# EAGLE design trans48 (EAGLE 6.3)
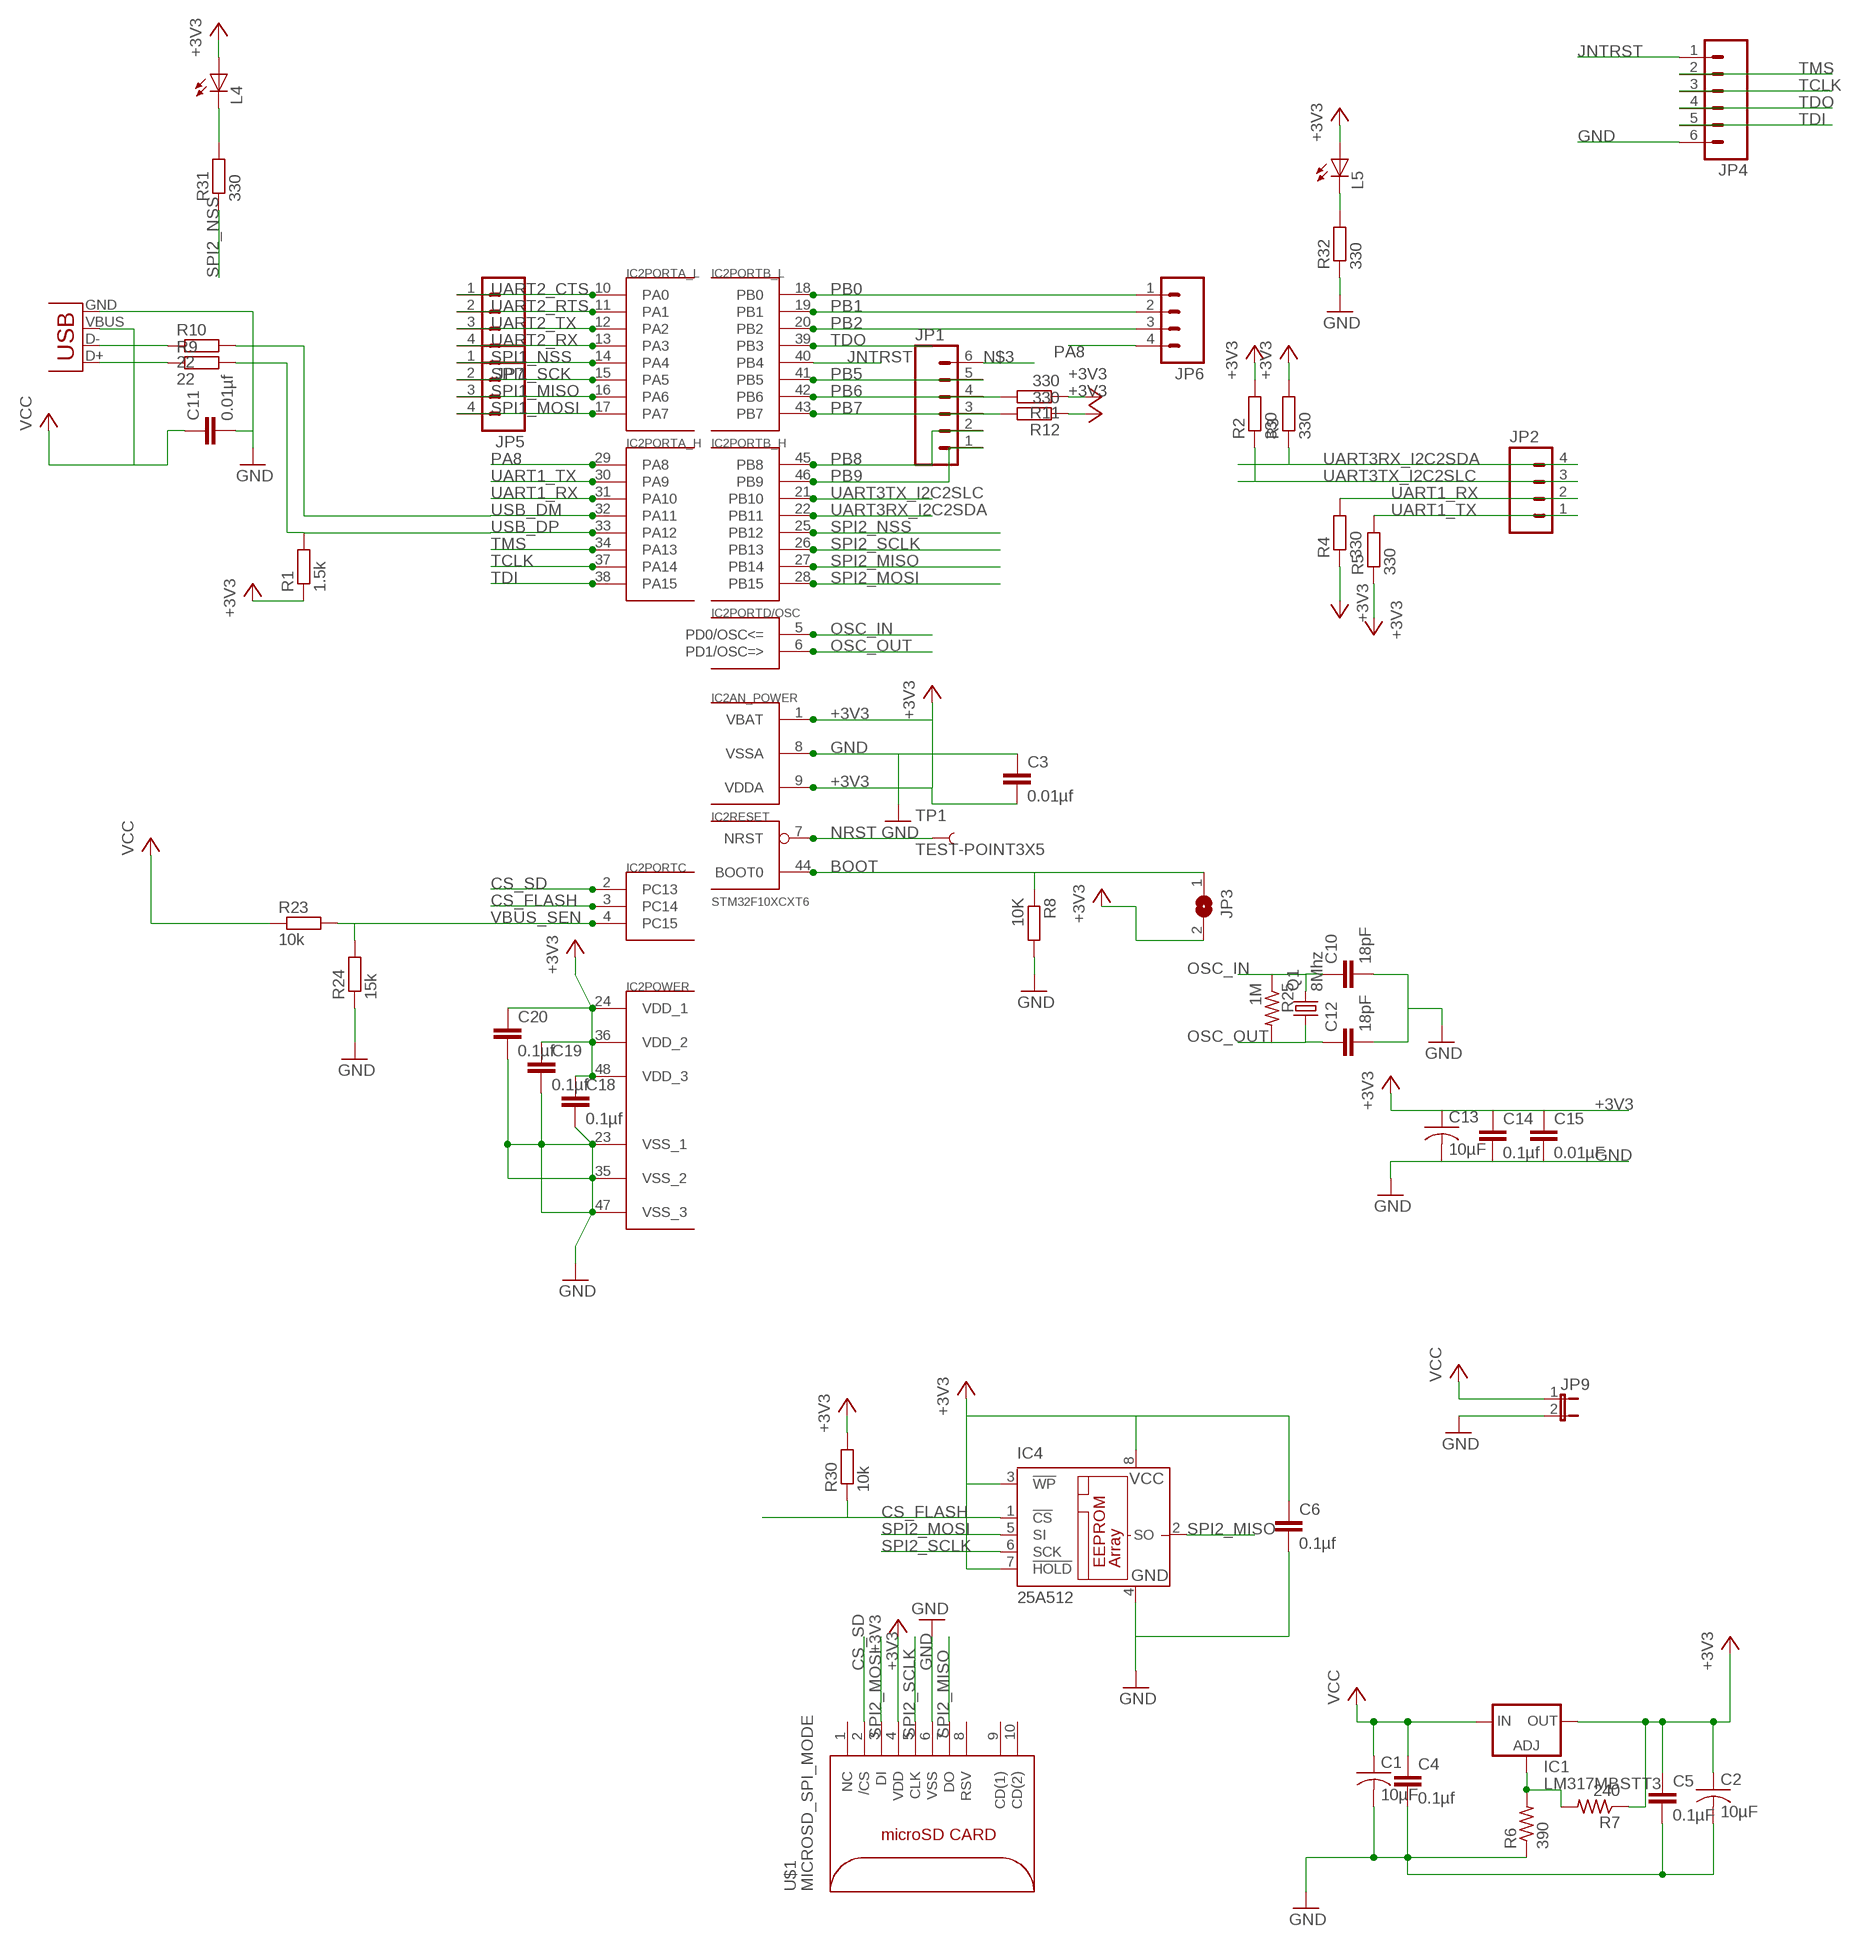
[diagram p0: schematic, sheet 1]

## Parts
C1  10µF  C-USC1206  [C1206]
C2  10µF  C-USC1206  [C1206]
C3  0.01µf  C-EUC0402  [C0402]
C4  0.1µf  C-EUC0402  [C0402]
C5  0.1µF  C-EUC0402  [C0402]
C6  0.1µf  C-EUC0402  [C0402]
C10  18pF  C-EUC0603  [C0603]
C11  0.01µf  C-EUC0402  [C0402]
C12  18pF  C-EUC0603  [C0603]
C13  10µF  C-USC1206  [C1206]
C14  0.1µf  C-EUC0603  [C0603]
C15  0.01µF  C-EUC0603  [C0603]
C18  0.1µf  C-EUC0402  [C0402]
C19  0.1µf  C-EUC0402  [C0402]
C20  0.1µf  C-EUC0402  [C0402]
IC1  LM317MBSTT3  [SOT223]
IC2  STM32F10XCXT6  [TQFP48]
IC4  25A512  25AA080SN  [SO-08]
JP1  M06EM406  [EM406]
JP2  M04SMD2  [1X04-1MM-RA]
JP3  SJ  [SJ]
JP4  M06EM406  [EM406]
JP5  M04SMD2  [1X04-1MM-RA]
JP6  M04SMD2  [1X04-1MM-RA]
JP7  M04SMD2  [1X04-1MM-RA]
JP9  JUMPER-2SMD-NO-NS  [SJ_2S-NO-NS]
L4  LEDSML0603  [SML0603]
L5  LEDSML0603  [SML0603]
Q1  8Mhz  CRYSTALSM49  [SM49]
R1  1.5k  R-EU_R0402  [R0402]
R2  330  R-EU_R0402  [R0402]
R3  330  R-EU_R0402  [R0402]
R4  330  R-EU_R0402  [R0402]
R5  330  R-EU_R0402  [R0402]
R6  390  R-US_R0603  [R0603]
R7  240  R-US_R0603  [R0603]
R8  10K  R-EU_R0402  [R0402]
R9  22  R-EU_R0402  [R0402]
R10  22  R-EU_R0402  [R0402]
R11  330  R-EU_R0402  [R0402]
R12  330  R-EU_R0402  [R0402]
R23  10k  R-EU_R0402  [R0402]
R24  15k  R-EU_R0402  [R0402]
R25  1M  R-US_R0603  [R0603]
R30  10k  R-EU_R0402  [R0402]
R31  330  R-EU_R0402  [R0402]
R32  330  R-EU_R0402  [R0402]
TP1  TEST-POINT3X5  [PAD.03X.05]
U$1  MICROSD_SPI_MODE  [MICRO_SD_CONNECTOR]
X1  USB-MICROB  [USB-MICROB]

## Nets
+3V3: C2.1 C3.2 C5.1 C6.1 C13.1 C14.1 C15.1 C18.1 C19.1 C20.1 IC1.4(OUT) IC2.1(AN_POWER:VBAT) IC2.9(AN_POWER:VDDA) IC2.24(POWER:VDD_1) IC2.36(POWER:VDD_2) IC2.48(POWER:VDD_3) IC4.3(!WP) IC4.7(!HOLD) IC4.8(VCC) JP3.2 L4.A L5.A R1.1 R2.2 R3.2 R4.1 R5.1 R7.1 R11.1 R12.1 R30.2 U$1.4(VDD)
BOOT: IC2.44(RESET:BOOT0) JP3.1 R8.1
CS_FLASH: IC2.3(PORTC:PC14) IC4.1(!CS) R30.1
CS_SD: IC2.2(PORTC:PC13) U$1.2(/CS)
GND: C1.2 C2.2 C3.1 C4.2 C5.2 C6.2 C10.2 C11.2 C12.2 C13.2 C14.2 C15.2 C18.2 C19.2 C20.2 IC2.8(AN_POWER:VSSA) IC2.23(POWER:VSS_1) IC2.35(POWER:VSS_2) IC2.47(POWER:VSS_3) IC4.4(GND) JP4.6 JP9.2 R6.1 R8.2 R24.1 R32.1 U$1.6(VSS) X1.GND
JNTRST: IC2.40(PORTB_L:PB4) JP4.1
N$1: R10.1 X1.D-
N$2: R9.1 X1.D+
N$3: JP1.6
N$14: L4.C R31.2
N$15: L5.C R32.2
N$34: IC1.1(ADJ) R6.2 R7.2
NRST: IC2.7(RESET:NRST) TP1.P$1
OSC_IN: C10.1 IC2.5(PORTD/OSC:PD0/OSC<=) Q1.2 R25.1
OSC_OUT: C12.1 IC2.6(PORTD/OSC:PD1/OSC=>) Q1.1 R25.2
PA8: IC2.29(PORTA_H:PA8) JP6.4
PB0: IC2.18(PORTB_L:PB0) JP6.1
PB1: IC2.19(PORTB_L:PB1) JP6.2
PB2: IC2.20(PORTB_L:PB2) JP6.3
PB5: IC2.41(PORTB_L:PB5) JP1.5
PB6: IC2.42(PORTB_L:PB6) JP1.4 R11.2
PB7: IC2.43(PORTB_L:PB7) JP1.3 R12.2
PB8: IC2.45(PORTB_H:PB8) JP1.2
PB9: IC2.46(PORTB_H:PB9) JP1.1
SPI1_MISO: IC2.16(PORTA_L:PA6) JP5.3
SPI1_MOSI: IC2.17(PORTA_L:PA7) JP5.4
SPI1_NSS: IC2.14(PORTA_L:PA4) JP5.1
SPI1_SCK: IC2.15(PORTA_L:PA5) JP5.2
SPI2_MISO: IC2.27(PORTB_H:PB14) IC4.2(SO) U$1.7(DO)
SPI2_MOSI: IC2.28(PORTB_H:PB15) IC4.5(SI) U$1.3(DI)
SPI2_NSS: IC2.25(PORTB_H:PB12) R31.1
SPI2_SCLK: IC2.26(PORTB_H:PB13) IC4.6(SCK) U$1.5(CLK)
TCLK: IC2.37(PORTA_H:PA14) JP4.3
TDI: IC2.38(PORTA_H:PA15) JP4.5
TDO: IC2.39(PORTB_L:PB3) JP4.4
TMS: IC2.34(PORTA_H:PA13) JP4.2
UART1_RX: IC2.31(PORTA_H:PA10) JP2.2 R4.2
UART1_TX: IC2.30(PORTA_H:PA9) JP2.1 R5.2
UART2_CTS: IC2.10(PORTA_L:PA0) JP7.1
UART2_RTS: IC2.11(PORTA_L:PA1) JP7.2
UART2_RX: IC2.13(PORTA_L:PA3) JP7.4
UART2_TX: IC2.12(PORTA_L:PA2) JP7.3
UART3RX_I2C2SDA: IC2.22(PORTB_H:PB11) JP2.4 R3.1
UART3TX_I2C2SLC: IC2.21(PORTB_H:PB10) JP2.3 R2.1
USB_DM: IC2.32(PORTA_H:PA11) R10.2
USB_DP: IC2.33(PORTA_H:PA12) R1.2 R9.2
VBUS_SEN: IC2.4(PORTC:PC15) R23.2 R24.2
VCC: C1.1 C4.1 C11.1 IC1.3(IN) JP9.1 R23.1 X1.VBUS
Unconnected: U$1.1(NC) U$1.8(RSV) U$1.9(CD(1)) U$1.10(CD(2))

## Library data of the parts
C1 C2 C13 = rcl:C-US: CAPACITOR, American symbol
C3-C6 C10-C12 C14 C15 C18-C20 = rcl:C-EU: CAPACITOR, European symbol
IC1 = v-reg:LM317?*: 500 mA Adjustable Output Positive Voltage Regulator Source: http://www.onsemi.co.jp .. LM317M-D.PDF
IC2 = stm32:STM32F10XCXT6: ST STM32F101/103 48pin LQFP
IC4 = microchip:25*: Serial EEPROM 4K/ 8K , SPI bus
JP1 JP4 = SparkFun:M06: Header 6 Standard 6-pin 0.1" header. Use with straight break away headers (SKU : PRT-00116), right angle break away headers (PRT-00553), swiss pins (PRT-00743), machine pins (PRT-00117), and female headers (PRT-00115). Molex polarized connector foot print use with SKU : PRT-08094 with associated crimp pins and housings. NOTES ON THE VARIANTS LOCK and LOCK_LONGPADS... This footprint was designed to help hold the alignment of a through-hole component (i.e. 6-pin header) while soldering it into place. You may notice that each hole has been shifted either up or down by 0.005 of an inch from it's more standard position (which is a perfectly straight line). This slight alteration caused the pins (the squares in the middle) to touch the edges of the holes. Because they are alternating, it causes a "brace" to hold the component in place. 0.005 has proven to be the perfect amount of "off-center" position when using our standard breakaway headers. Although looks a little odd when you look at the bare footprint, once you have a header in there, the alteration is very hard to notice. Also, if you push a header all the way into place, it is covered up entirely on the bottom side. This idea of altering the position of holes to aid alignment will be further integrated into the Sparkfun Library for other footprints. It can help hold any component with 3 or more connection pins.
JP2 JP5-JP7 = SparkFun:M04: Header 4 Standard 4-pin 0.1" header. Use with straight break away headers (SKU : PRT-00116), right angle break away headers (PRT-00553), swiss pins (PRT-00743), machine pins (PRT-00117), and female headers (PRT-00115). Molex polarized connector foot print use with SKU : PRT-08231 with associated crimp pins and housings. 1MM SMD Version SKU: PRT-10208
JP3 = jumper:SJ: SMD solder JUMPER
JP9 = SparkFun:JUMPER-2: Jumper Basic 0.1" spaced jumper. Use with breakaway headers.
L4 L5 = led:LED: LED OSRAM: - CHIPLED LG R971, LG N971, LY N971, LG Q971, LY Q971, LO R971, LY R971 LH N974, LH R974 LS Q976, LO Q976, LY Q976 LO Q996 - Hyper CHIPLED LW Q18S LB Q993, LB Q99A, LB R99A - SideLED LS A670, LO A670, LY A670, LG A670, LP A670 LB A673, LV A673, LT A673, LW A673 LH A674 LY A675 LS A676, LA A676, LO A676, LY A676, LW A676 LS A679, LY A679, LG A679 - Hyper Micro SIDELED® LS Y876, LA Y876, LO Y876, LY Y876 LT Y87S - SmartLED LW L88C, LW L88S LB L89C, LB L89S, LG L890 LS L89K, LO L89K, LY L89K LS L896, LA L896, LO L896, LY L896 - TOPLED LS T670, LO T670, LY T670, LG T670, LP T670 LSG T670, LSP T670, LSY T670, LOP T670, LYG T670 LG T671, LOG T671, LSG T671 LB T673, LV T673, LT T673, LW T673 LH T674 LS T676, LA T676, LO T676, LY T676, LB T676, LH T676, LSB T676, LW T676 LB T67C, LV T67C, LT T67C, LS T67K, LO T67K, LY T67K, LW E67C LS E67B, LA E67B, LO E67B, LY E67B, LB E67C, LV E67C, LT E67C LW T67C LS T679, LY T679, LG T679 LS T770, LO T770, LY T770, LG T770, LP T770 LB T773, LV T773, LT T773, LW T773 LH T774 LS E675, LA E675, LY E675, LS T675 LS T776, LA T776, LO T776, LY T776, LB T776 LHGB T686 LT T68C, LB T68C - Hyper Mini TOPLED® LB M676 - Mini TOPLED Santana® LG M470 LS M47K, LO M47K, LY M47K Source: http://www.osram.convergy.de LUXEON: - LUMILED® LXK2-PW12-R00, LXK2-PW12-S00, LXK2-PW14-U00, LXK2-PW14-V00 LXK2-PM12-R00, LXK2-PM12-S00, LXK2-PM14-U00 LXK2-PE12-Q00, LXK2-PE12-R00, LXK2-PE12-S00, LXK2-PE14-T00, LXK2-PE14-U00 LXK2-PB12-K00, LXK2-PB12-L00, LXK2-PB12-M00, LXK2-PB14-N00, LXK2-PB14-P00, LXK2-PB14-Q00 LXK2-PR12-L00, LXK2-PR12-M00, LXK2-PR14-Q00, LXK2-PR14-R00 LXK2-PD12-Q00, LXK2-PD12-R00, LXK2-PD12-S00 LXK2-PH12-R00, LXK2-PH12-S00 LXK2-PL12-P00, LXK2-PL12-Q00, LXK2-PL12-R00 Source: www.luxeon.com KINGBRIGHT: KA-3528ASYC Source: www.kingbright.com
Q1 = crystal:CRYSTAL: CRYSTAL
R1-R5 R8-R12 R23 R24 R30-R32 = rcl:R-EU_: RESISTOR, European symbol
R6 R7 R25 = resistor:R-US_: RESISTOR, American symbol
TP1 = SparkFun:TEST-POINT
U$1 = con-molex-microsd:MICROSD_SPI_MODE: MOLEX - 49225-0821 - CONNECTEUR MICRO SD PUSH/PUSH REV Fabricant: MOLEX Code commande Farnell: 1366700 <http://fr.farnell.com/molex/49225-0821/connecteur-micro-sd-push-push-rev/dp/1366700?Ntt=1366700> Référence fabricant: 49225-0821
X1 = SparkFun:USB: USB Connectors USB-B-PTH is fully proven SKU : PRT-00139 USB-miniB is fully proven SKU : PRT-00587 USB-A-PCB is untested. USB-A-H is throughly reviewed, but untested. Spark Fun Electronics SKU : PRT-00437 USB-B-SMT is throughly reviewed, but untested. Needs silkscreen touching up. USB-A-S has not been used/tested USB-MB-H has not been used/tested

## Board
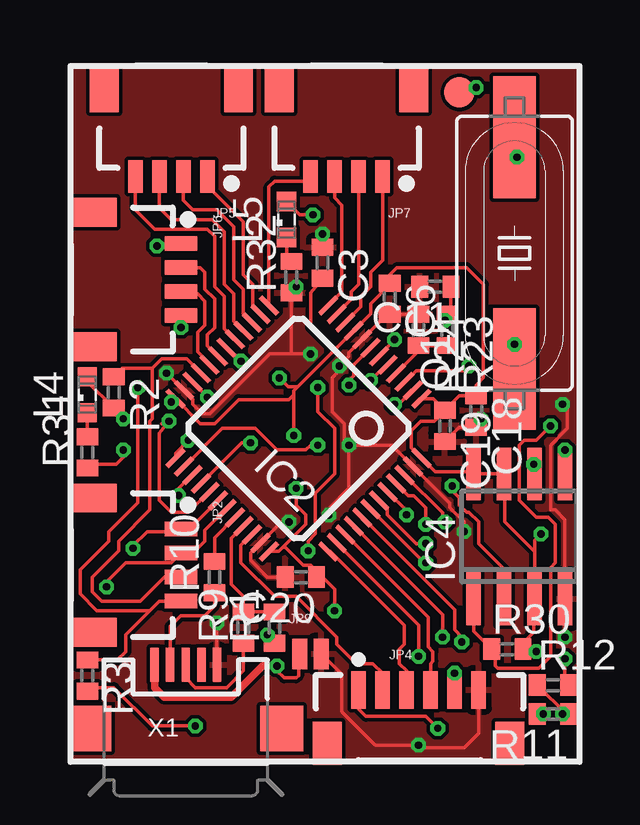
[diagram p1: board, top side]
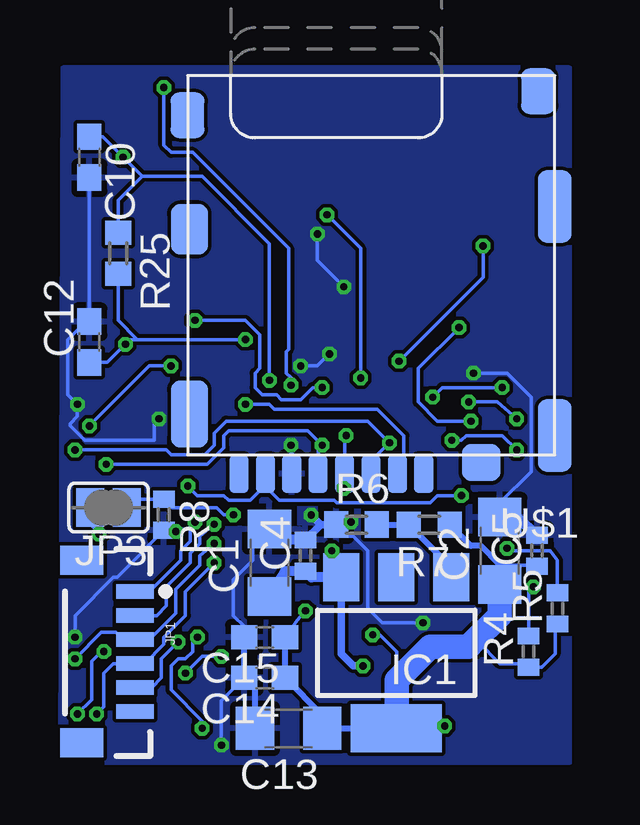
[diagram p2: board, bottom side, seen from below]

No outline drawn. Coordinates in mm, seen from the top.
Copper layers (1*16): Top 0.035mm / dielectric 1.5mm / Bottom 0.035mm
Design rules "Fusion_eagle_rule_v1.1": minimum track width 6mil, minimum drill 12mil, track to track 6mil, track to pad 6mil, pad to pad 6mil, via to via 6mil, smd to smd 0mil, copper to edge 10mil, drill to drill 10mil, minimum pad ring 10mil, minimum via ring 6mil, stop-mask expansion 2mil, vias tented up to drill 100mil, thermal gap 10mil

### Footprints (pad centres in the part's own frame; a part is rotated, then mirrored left to right if it is on the bottom)
C1206 = smd 1.6 x 1.8: 1 -1.4,0; 2 1.4,0
C0402 = smd 0.7 x 0.9: 1 -0.65,0; 2 0.65,0
C0603 = smd 1.1 x 1: 1 -0.85,0; 2 0.85,0
SOT223 = smd 1.5 x 2: 1 -2.3,-3.15; 2 0,-3.15; 3 2.3,-3.15 | smd 3.8 x 2: 4 0,3.15
TQFP48 = smd 0.2 x 1: 1 -2.75,-4.5; 2 -2.25,-4.5; 3 -1.75,-4.5; 4 -1.25,-4.5; 5 -0.75,-4.5; 6 -0.25,-4.5; 7 0.25,-4.5; 8 0.75,-4.5; 9 1.25,-4.5; 10 1.75,-4.5; 11 2.25,-4.5; 12 2.75,-4.5; 25 2.75,4.5; 26 2.25,4.5; 27 1.75,4.5; 28 1.25,4.5; 29 0.75,4.5; 30 0.25,4.5; 31 -0.25,4.5; 32 -0.75,4.5; 33 -1.25,4.5; 34 -1.75,4.5; 35 -2.25,4.5; 36 -2.75,4.5 | smd 1 x 0.2: 13 4.5,-2.75; 14 4.5,-2.25; 15 4.5,-1.75; 16 4.5,-1.25; 17 4.5,-0.75; 18 4.5,-0.25; 19 4.5,0.25; 20 4.5,0.75; 21 4.5,1.25; 22 4.5,1.75; 23 4.5,2.25; 24 4.5,2.75; 37 -4.5,2.75; 38 -4.5,2.25; 39 -4.5,1.75; 40 -4.5,1.25; 41 -4.5,0.75; 42 -4.5,0.25; 43 -4.5,-0.25; 44 -4.5,-0.75; 45 -4.5,-1.25; 46 -4.5,-1.75; 47 -4.5,-2.25; 48 -4.5,-2.75
SO-08 = smd 0.6 x 2.2: 1 -1.905,-2.6; 2 -0.635,-2.6; 3 0.635,-2.6; 4 1.905,-2.6; 5 1.905,2.6; 6 0.635,2.6; 7 -0.635,2.6; 8 -1.905,2.6
EM406 = smd 0.6 x 1.55: 1 0,0; 2 1,0; 3 2,0; 4 3,0; 5 4,0; 6 5,0 | smd 1.2 x 1.8: P$1 -1.3,-2.225; P$2 6.3,-2.225
1X04-1MM-RA = smd 0.6 x 1.35: 1 -1.5,0; 2 -0.5,0; 3 0.5,0; 4 1.5,0 | smd 1.2 x 2: NC1 2.8,-3.675; NC2 -2.8,-3.675
SJ = smd 1.168 x 1.6: 1 -0.762,0; 2 0.762,0
SJ_2S-NO-NS = smd 0.635 x 1.27: 1 -0.45,0; 2 0.45,0
SML0603 = smd 0.8 x 0.8: A 0.75,0; C -0.75,0
SM49 = smd 5.08 x 1.778: 1 -4.826,0; 2 4.826,0
R0402 = smd 0.7 x 0.9: 1 -0.65,0; 2 0.65,0
R0603 = smd 1 x 1.1: 1 -0.85,0; 2 0.85,0
PAD.03X.05 = smd 1.27 x 1.27: P$1 0,0
MICRO_SD_CONNECTOR = smd 0.8 x 1.6: 1 -2.03,8.2; 2 -0.93,8.2; 3 0.17,8.2; 4 1.27,8.2; 5 2.37,8.2; 6 3.47,8.2; 7 4.57,8.2; 8 5.67,8.2 | smd 1.55 x 2.8: 9 7.735,5.7 | smd 1.55 x 2.1: 10 7.735,-2 | smd 1.4 x 1.9: 11 7.81,-6.75; 12 -6.79,-7.75 | smd 1.4 x 3: 13 -7.49,-2.95; 14 -7.49,6.6 | smd 1.6 x 1.55: 15 -4.43,7.725
USB-MICROB = smd 0.35 x 1.4: D+ 0,2.65; D- -0.65,2.65; GND 1.3,2.65; ID 0.65,2.65; VBUS -1.3,2.65 | smd 1.8 x 1.9: MT1 -4,0; MT2 4,0

### Placement (x,y rotation side)
C1  12.5,8.3 90 bottom
C2  2.9,8.8 90 bottom
C3  10.5,20.8 270 top
C4  11,8.6 90 bottom
C5  1.35,8.8 90 bottom
C6  13.3,19.3 270 top
C10  20,25.2 270 bottom
C11  15.2,19.8 180 top
C12  20,17.5 90 bottom
C13  11.7,1.4 180 bottom
C14  12.7,3.5 180 bottom
C15  12.7,5.2 180 bottom
C18  16.9,14.6 270 top
C19  15.6,14 270 top
C20  9.6,7.7 180 top
IC1  7.22,4.55 180 bottom
IC2  9.5,13.9 135 top
IC4  18.7,9.4 0 top
JP1  18.1,7.1 270 bottom
JP2  4.6,8.2 270 top
JP3  19.2,10.6 180 bottom
JP4  12,3 0 top
JP5  4.2,24.4 180 top
JP6  4.6,20.1 270 top
JP7  11.5,24.4 180 top
JP9  10,4.5 0 top
L4  0.7,15.3 90 top
L5  9,22.6 90 top
Q1  18.5,21.2 90 top
R1  8.5,5.6 90 top
R2  1.8,15.4 270 top
R3  0.7,3.6 270 top
R4  1.7,4.6 90 bottom
R5  0.5,6.4 90 bottom
R6  8.87,9.89 0 bottom
R7  5.84,9.89 180 bottom
R8  16.9,10.3 270 bottom
R9  7.2,5.6 90 top
R10  6,7.7 90 top
R11  20.1,2 180 top
R12  20.1,3.2 0 top
R23  15.7,18 270 top
R24  14.5,18 270 top
R25  18.8,21.2 270 bottom
R30  18.2,4.7 0 top
R31  0.7,12.9 90 top
R32  9.2,20.2 90 top
TP1  16.2,27.9 0 top
U$1  8.1,20.2 180 bottom
X1  4.8,1.4 0 top

### Tracks (layer width: path | path; a pad name or v marks a point on that pad's centre or on a via)
+3V3  (via drill 0.3)
  Top 0.152: 19.34,8.77 IC4.3 19.3,6.57 19.3,5.4 18.85,4.95 R30.2 19.3,4.7 v19.4,4.6 | 19.34,8.77 18.1,10 18.1,11.77 IC4.7 IC4.8 16.5,12.1 15.2,12.1 IC2.48 14.63,12.67 14.2,13.1 14.2,13.8 14.6,14.2 15.15,14.2 C19.1 | 19.34,8.77 19.34,9.23 v19.6,9.5 | 8.6,9.1 8.27,8.77 IC2.36 | C19.1 15.11,15.14 IC2.1 | C19.1 16.2,15.25 C18.1 16.9,15.7 17.2,16 17.2,19.9 16.5,20.6 13.6,20.6 13.3,20.3 C6.1 13.3,19.9 12.5,19.1 12.5,18.67 IC2.9 10.97,17.13 | v11,6.3 11,7.2 10.5,7.7 C20.1 10.25,7.95 10,8.2 9.7,8.2 8.95,8.95 8.85,8.95 | v9.4,11.4 9.4,10.7 9.8,10.3 9.8,9.9 8.85,8.95 | v8.2,5.3 8.2,5.25 R1.1 | v9.3,13.6 9.3,15.3 | 9.3,15.3 9.3,15.47 9.47,15.63 | 9.47,15.63 10.97,17.13 | 8.29,8.8 IC2.36 | 9.3,15.3 9.1,15.1 7,15.1 6,14.1 5.41,14.1 IC2.24 4.34,15.14 v4.2,15 | 8.85,8.95 8.67,8.77 IC2.36 | L4.A 0.7,15.85 R2.2 2.2,14.35 v2.2,14.3 | R3.2 0.85,3.1 1.8,3.1 3.4,1.5 v5.2,1.5 | L5.A 9.55,22.8 v10.1,22.8 | v8.7,16 9.07,15.63 9.47,15.63 | R12.1 20.65,2 v20.5,2 R11.1 | C3.2 10,19.55 10,18.1 10.97,17.13 | 10.97,17.13
  Bottom 0.152: v19.6,9.5 20,9.94 JP3.2 | v11,6.3 11.35,5.9 C15.1 | v9.4,11.4 9.37,11.43 U$1.4 9.37,13.53 v9.3,13.6 | 7.2,3.4 7.2,4.6 7.9,5.3 v8.2,5.3 | v2.2,14.3 3,15 v4.2,15 | v5.2,1.5 5.3,1.4 IC1.4 | C5.1 1.4,8.2 2.9,8.2 | R5.1 0.6,5.65 0.6,4.5 1.15,3.95 R4.1 1.85,4.1 2.9,4.1 3.8,5 4,5 | v10.1,22.8 8.7,21.4 v8.7,16 | v20.5,2 19.9,2.6 19.9,4.2 19.5,4.6 v19.4,4.6
  Bottom 0.254: C2.1 2.9,8.2 3.7,9 4.1,9 R7.1 | C15.1 C14.1 10.3,1.95 C13.1 IC1.4
  Bottom 1.016: C2.1 2.9,6.1 4,5 4.2,4.8 5.8,4.8 7.2,3.4 7.2,1.41 IC1.4
BOOT  (via drill 0.3)
  Top 0.152: 13.25,11.25 IC2.44 14,10.46 v14,10.3
  Bottom 0.152: JP3.1 18.09,10.95 R8.1 16.55,10.6 14.7,10.6 14.4,10.3 v14,10.3
CS_FLASH  (via drill 0.3)
  Top 0.152: IC4.1 16.8,5.46 R30.1 17.7,4.55 17.7,4 17.8,3.9 19.5,3.9 20,4.4 20,8.1 20.2,8.3 20.2,9.9 19.9,10.2 19.4,10.2 18.7,10.9 18.7,13.2 18.9,13.4 19.4,13.4 v20,14 | IC2.3 13.95,15.85 14.4,16.3 16.4,16.3 v16.6,16.5
  Bottom 0.152: v16.6,16.5 17.5,16.5 v20,14
CS_SD  (via drill 0.3)
  Top 0.152: v13.5,14.9 13.68,14.9 IC2.2
  Bottom 0.152: U$1.2 6.9,12.27 6.9,13.6 8,14.7 12.3,14.7 12.5,14.9 v13.5,14.9
GND  (via drill 0.3)
  Top 0.152: v11.6,13.2 13.38,13.2 13.54,13.04 | 13.54,13.04 IC2.47 15.8,10.78 15.8,10.6 16.4,10 v16.4,9.6 | 13.54,13.04 | C18.2 16.2,13.95 C19.2 15.35,13.6 | 16.95,13.95 C18.2 | v20.6,5.2 v20.61,5.21 IC4.4 20.6,6.61 20.6,10.1 20.2,10.5 20,10.5 20,13.2 20.7,13.9 20.7,14.7 v20.5,14.9 | R24.1 C6.2 13.19,18.65 IC2.8 11.6,17.06 11.6,16.9 v11.2,16.5 11.2,16.3 10.9,16 10.9,14.6 11.4,14.1 11.4,13.4 v11.6,13.2 | v9.1,10 8.8,10 7.93,9.13 IC2.35 7.5,8.72 7.5,8.4 8.2,7.7 C20.2 | X1.GND v6.1,5.8 | v17.1,14.3 17.2,14.25 C18.2 | v10.76,10.29 10.76,10.56 11.6,11.4 v11.6,13.2 | v4,16.2 4.71,15.49 IC2.23 5.1,15.12 5.1,14.9 5.5,14.5 5.8,14.5 8.3,17 9.2,17 | v10,17 9.2,17 | JP4.6 17,1.2 16.4,0.6 14.6,0.6 v14.5,0.7 12.7,0.7 11.3,2.1 11.3,3.65 JP9.2 | 9.2,17 R32.1 9.4,19.75 v9.4,19.8 | v10.5,22 C3.1
  Bottom 0.152: U$1.6 11.57,13.17 v11.6,13.2 | v20.6,5.2 20.6,6.1 19,7.7 18.85,7.7 R8.2 16.45,9.65 v16.4,9.6 | C15.2 13.55,5.65 14,6.1 14,7.6 13.2,8.4 13.2,9 C1.2 | v9.1,10 9.61,10 R6.1 9.23,9.4 9,9.4 8.4,8.8 8.4,6.4 7.8,5.8 v6.1,5.8 | v17.1,14.3 17.3,14.3 17.3,13.4 20.2,13.4 20.8,14 20.8,14.1 20.5,14.4 v20.5,14.9 20.9,15.3 20.9,17.6 20.15,18.35 C12.2 C10.2 | v4,16.2 2.6,16.2 1.6,15.2 1.6,12.1 2.9,10.8 C2.2 | v11.2,16.5 10.5,16.5 v10,17 | C14.2 14.5,2.55 v14.5,0.7 | v9.4,19.8 10.5,20.9 v10.5,22
  Bottom 0.254: C15.2 C14.2 13.1,3.05 C13.2 13.05,1.35
  Bottom 0.305: R6.1 10.36,9.89 | 10.36,9.89 C4.2 | 10.36,9.89 v10.76,10.29
  Bottom 0.406: C2.2 2.2,10.2 C5.2 | C4.2 11.85,9.25 C1.2
  pour Bottom: 0,0 0,28.9 21.1,28.9 21.2,0
  pour Top: 0,0 0,28.9 21.1,28.9 21.2,0
JNTRST  (via drill 0.3)
  Top 0.152: IC2.40 15.5,6.13 v15.5,5.2 | v15.3,1.4 14.8,1.9 12.3,1.9 12,2.2 JP4.1
  Bottom 0.152: v15.5,5.2 15.7,5 15.7,4.6 16,4.3 16.3,4.3 16.6,4 16.6,3 15.3,1.7 v15.3,1.4
N$1
  Top 0.152: X1.D- 4.15,5.65 4.6,6.1 5.6,6.1 6,6.5 R10.1
N$2
  Top 0.152: X1.D+ 4.8,3.5 5.2,3.1 6.5,3.1 7.2,3.8 R9.1
N$14
  Top 0.152: R31.2 L4.C
N$15
  Top 0.152: R32.2 9,21.05 L5.C
N$34
  Bottom 0.254: IC1.1 4.92,8.12 R7.2 R6.2
NRST  (via drill 0.3)
  Top 0.152: IC2.7 11.8,16.55 11.8,16.1 11.6,15.9 v11.6,15.7 | v16.9,28.1 16.7,27.9 TP1.P$1
  Bottom 0.152: v16.9,28.1 16.9,25.7 16.6,25.4 15.7,25.4 11.7,21.4 11.7,17.2 11.8,17.1 11.8,16.2 11.6,16 v11.6,15.7
OSC_IN  (via drill 0.3)
  Top 0.152: IC2.5 13.15,16.55 v12.5,15.9 | v18.6,25.2 18.6,25.93 Q1.2
  Bottom 0.152: 17.8,24.4 15.3,24.4 12.5,21.6 v12.5,15.9 | 17.8,24.4 v18.6,25.2 19.45,26.05 C10.1 | R25.1 18.8,23.4 17.8,24.4
OSC_OUT  (via drill 0.3)
  Top 0.152: IC2.6 12.86,16.96 v13.5,17.6 | v18.5,17.4 Q1.1
  Bottom 0.152: v13.5,17.6 18,17.6 | 18,17.6 18.3,17.6 v18.5,17.4 19.25,16.65 C12.1 | R25.2 18.8,18.4 18,17.6
PA8  (via drill 0.3)
  Top 0.152: IC2.29 5.75,11.25 4.9,10.4 4.2,10.4 3.7,10.9 3.7,13.7 v4.1,14.2 3.8,14.1 | v4.6,18.1 JP6.4
  Bottom 0.152: v4.1,14.2 5.5,14.2 6.3,15 6.3,16.4 v4.6,18.1
PB0  (via drill 0.3)
  Top 0.152: IC2.18 7.05,16.7 v7.1,16.7 | v3.6,21.5 3.7,21.6 JP6.1
  Bottom 0.152: v7.1,16.7 3.6,20.2 v3.6,21.5
PB1
  Top 0.152: IC2.19 5.7,17.35 5.7,17.8 6,18.1 6,19.3 5.6,19.7 5.6,20.4 5.4,20.6 JP6.2
PB2
  Top 0.152: JP6.3 4.7,19.5 5.3,19.5 5.6,19.2 5.6,18.2 5.3,17.9 5.3,17.1 5.79,16.61 IC2.20
PB5  (via drill 0.3)
  Top 0.152: v16.3,5 16.3,5.2 16,5.5 16,6.34 IC2.41
  Bottom 0.152: JP1.5 17.4,3.1 17,3.5 17,4.3 v16.3,5
PB6  (via drill 0.3)
  Top 0.152: v14.8,8.3 14.75,8.3 IC2.42 | R11.2 v19.7,2
  Bottom 0.152: v14.8,8.3 16,7.1 16,6.1 16.9,5.2 16.9,4.9 17.7,4.1 JP1.4 19,4.1 19.4,3.7 19.4,2.3 v19.7,2
PB7  (via drill 0.3)
  Top 0.152: IC2.43 13.2,10.55 13.2,10.3 14.4,9.1 v14.8,9.1 | R12.2 20.6,3.35 v20.6,4.3
  Bottom 0.152: v14.8,9.1 15.4,8.6 15.4,8.2 16.4,7.2 16.4,6.2 17.5,5.1 JP1.3 18.6,5.1 18.9,5.4 19.5,5.4 v20.6,4.3
PB8  (via drill 0.3)
  Top 0.152: v14.8,9.9 14.8,10.6 14.3,11.1 14.07,11.1 IC2.45
  Bottom 0.152: JP1.2 17.2,6.1 16.8,6.5 16.8,7.3 15.8,8.3 15.8,8.7 15.4,9.1 15.4,9.4 v14.8,9.9
PB9  (via drill 0.3)
  Top 0.152: IC2.46 15.5,10.38 15.5,10.1 v15.6,10
  Bottom 0.152: JP1.1 17.5,7.1 16.2,8.4 16.2,8.8 15.8,9.2 15.8,9.8 v15.6,10
SPI1_MISO
  Top 0.152: IC2.16 6.8,18.37 6.8,19.5 6.4,19.9 6.4,22.1 5.9,22.6 4.2,22.6 3.7,23.1 JP5.3
SPI1_MOSI
  Top 0.152: IC2.17 6.4,18.06 6.4,19.4 6,19.8 6,21.9 5.7,22.2 3.5,22.2 2.7,23 JP5.4
SPI1_NSS
  Top 0.152: IC2.14 7.6,18.98 7.6,19.9 7.2,20.3 7.2,22.5 5.7,24 JP5.1
SPI1_SCK
  Top 0.152: IC2.15 7.2,18.68 7.2,19.7 6.8,20.1 6.8,22.3 6.1,23 5.1,23 4.7,23.4 JP5.2
SPI2_MISO  (via drill 0.3)
  Top 0.152: IC2.27 5.05,11.96 4.5,11.4 v4.5,11.1 | IC4.2 18.1,6.63 18.1,8 17,9.1 17,10 16.6,10.4 16.5,10.4 16.2,10.7 16.2,11 15.9,11.3 v15.9,11.5
  Bottom 0.152: v4.5,11.1 5.5,11.1 5.8,10.8 9.7,10.8 9.8,10.9 12.1,10.9 12.6,11.4 | 12.6,11.4 12.6,11.93 U$1.7 | v15.9,11.5 15.5,11.1 14.4,11.1 14.2,10.9 13.3,10.9 12.8,11.4 12.6,11.4
SPI2_MOSI  (via drill 0.3)
  Top 0.152: v7.5,13.3 7.13,13.3 IC2.28 | 20.61,12.2 IC4.5 v20.61,12.99 v20.6,13
  Bottom 0.152: U$1.3 8.27,12.53 v7.5,13.3 8.4,14.2 14.3,14.2 14.8,13.7 14.8,13.2 15.2,12.8 16.6,12.8 16.8,13 v20.6,13
SPI2_NSS  (via drill 0.3)
  Top 0.152: R31.1 0.85,12.4 1.9,12.4 2.2,12.7 v2.2,13 | v4.9,13.4 4.37,12.87 IC2.25
  Bottom 0.152: v2.2,13 2.8,13.6 4.3,13.6 4.5,13.4 v4.9,13.4
SPI2_SCLK  (via drill 0.3)
  Top 0.152: IC2.26 6.32,13.9 7.7,13.9 8.6,13 9.8,13 10,13.2 v10.3,13.2 | IC4.6 19.34,12.16 v19.3,12.4
  Bottom 0.152: U$1.5 10.47,13.03 v10.3,13.2 10.9,13.8 14.2,13.8 14.4,13.6 14.4,13.1 15.1,12.4 v19.3,12.4
TCLK
  Top 0.152: JP4.3 14,3.8 13.7,4.1 13.7,4.7 13.9,4.9 13.9,5.7 10.83,8.77 IC2.37
TDI  (via drill 0.3)
  Top 0.152: IC2.38 11.09,9.11 14.5,5.7 v14.5,4.4 | v16,3.7 JP4.5
  Bottom 0.152: v14.5,4.4 15.3,4.4 v16,3.7
TDO
  Top 0.152: JP4.4 15,4.1 15.1,4.2 15.1,4.6 14.9,4.8 14.9,6.03 IC2.39
TMS
  Top 0.152: IC2.34 7.1,9.03 7.1,8.3 8.5,6.9 9.4,6.9 11.1,5.2 11.1,4.9 11.9,4.1 12.6,4.1 13,3.7 JP4.2
UART1_RX  (via drill 0.3)
  Top 0.152: IC2.31 5.6,9.65 5.6,9.2 5.1,8.7 JP2.2 4.2,8.3 2.3,8.3 1.5,7.5 v1.5,7.3
  Bottom 0.152: v1.5,7.3 1.7,7.1 R4.2
UART1_TX  (via drill 0.3)
  Top 0.152: IC2.30 4.95,9.7 JP2.1 4.5,9.6 3.2,9.6 2.6,9 v2.6,8.9
  Bottom 0.152: v2.6,8.9 2.5,8.8 0.8,8.8 0.5,8.4 R5.2
UART2_CTS
  Top 0.152: IC2.10 12.1,18.98 12.1,19.4 12.5,19.8 12.5,20.4 13,20.9 JP7.1
UART2_RTS
  Top 0.152: IC2.11 11.7,19.28 11.7,19.6 12,19.9 JP7.2
UART2_RX
  Top 0.152: IC2.13 8.26,23.96 8.5,24.2 9.8,24.2 JP7.4
UART2_TX
  Top 0.152: JP7.3 11,23.5 11.3,23.2 11.3,19.6 IC2.12
UART3RX_I2C2SDA  (via drill 0.3)
  Top 0.152: JP2.4 3.7,6.7 3.3,6.3 | v5.7,15.2 5.7,15.22 IC2.22 | 3.3,6.3 2.3,5.3 2.3,4.6 1.95,4.25 R3.1 | 3.3,6.3 1.1,6.3 0.4,7 0.4,8 1.6,9.2 1.6,9.6 2.8,10.8 v2.8,15.6
  Bottom 0.152: v2.8,15.6 5.3,15.6 v5.7,15.2
UART3TX_I2C2SLC
  Top 0.152: JP2.3 3.9,7.7 2.9,6.7 1.3,6.7 0.9,7.1 0.9,7.7 2,8.8 2,9.2 3.3,10.5 3.3,14.2 3.4,14.3 3.4,16.4 | IC2.21 4.83,16.8 3.8,16.8 3.4,16.4 | R2.1 2.15,16.4 3.4,16.4
USB_DM
  Top 0.152: R10.2 6,9.34 IC2.32
USB_DP
  Top 0.152: R1.2 R9.2 7.2,6.9 6.7,7.4 6.7,9.33 IC2.33
VBUS_SEN
  Top 0.152: IC2.4 14.5,17.13 R24.2 R23.2
VCC  (via drill 0.3)
  Top 0.152: C11.1 15.85,18.8 R23.1 15.7,18.5 v15.6,18.4 | v9.9,8.8 9.9,9.2 10.2,9.5 10.2,11.2 11,12 11,13.9 10.3,14.6 v10.3,15.6 | JP9.1 9.5,4.45 9.5,3.6 9.4,3.5 8.9,3.5 8.6,3.8 v8.6,4
  Top 0.305: X1.VBUS 3.5,3.1 3.9,2.7 6.7,2.7 8,4 v8.6,4
  Bottom 0.152: v15.6,18.4 13.5,18.4 12.9,17.8 12.9,16.4 13.1,16.2 13.1,15.6 12.8,15.3 12.2,15.3 12,15.1 11.2,15.1 10.7,15.6 v10.3,15.6 | v9.9,8.8 9.9,8.08 IC1.3
  Bottom 0.305: v8.6,4 9,4 9.5,4.5 9.5,7.68 IC1.3
  Bottom 0.406: IC1.3 10.75,7.7 C4.1 11.85,7.95 C1.1